# EasyEDA schematic 10MHz_reference_sch.json
TITLE: Sheet_1; REV: 1.0; Date: 2024-07-30; Sheet: 1/1; Drawn By: vinay.shanbhag; Company: Your Company
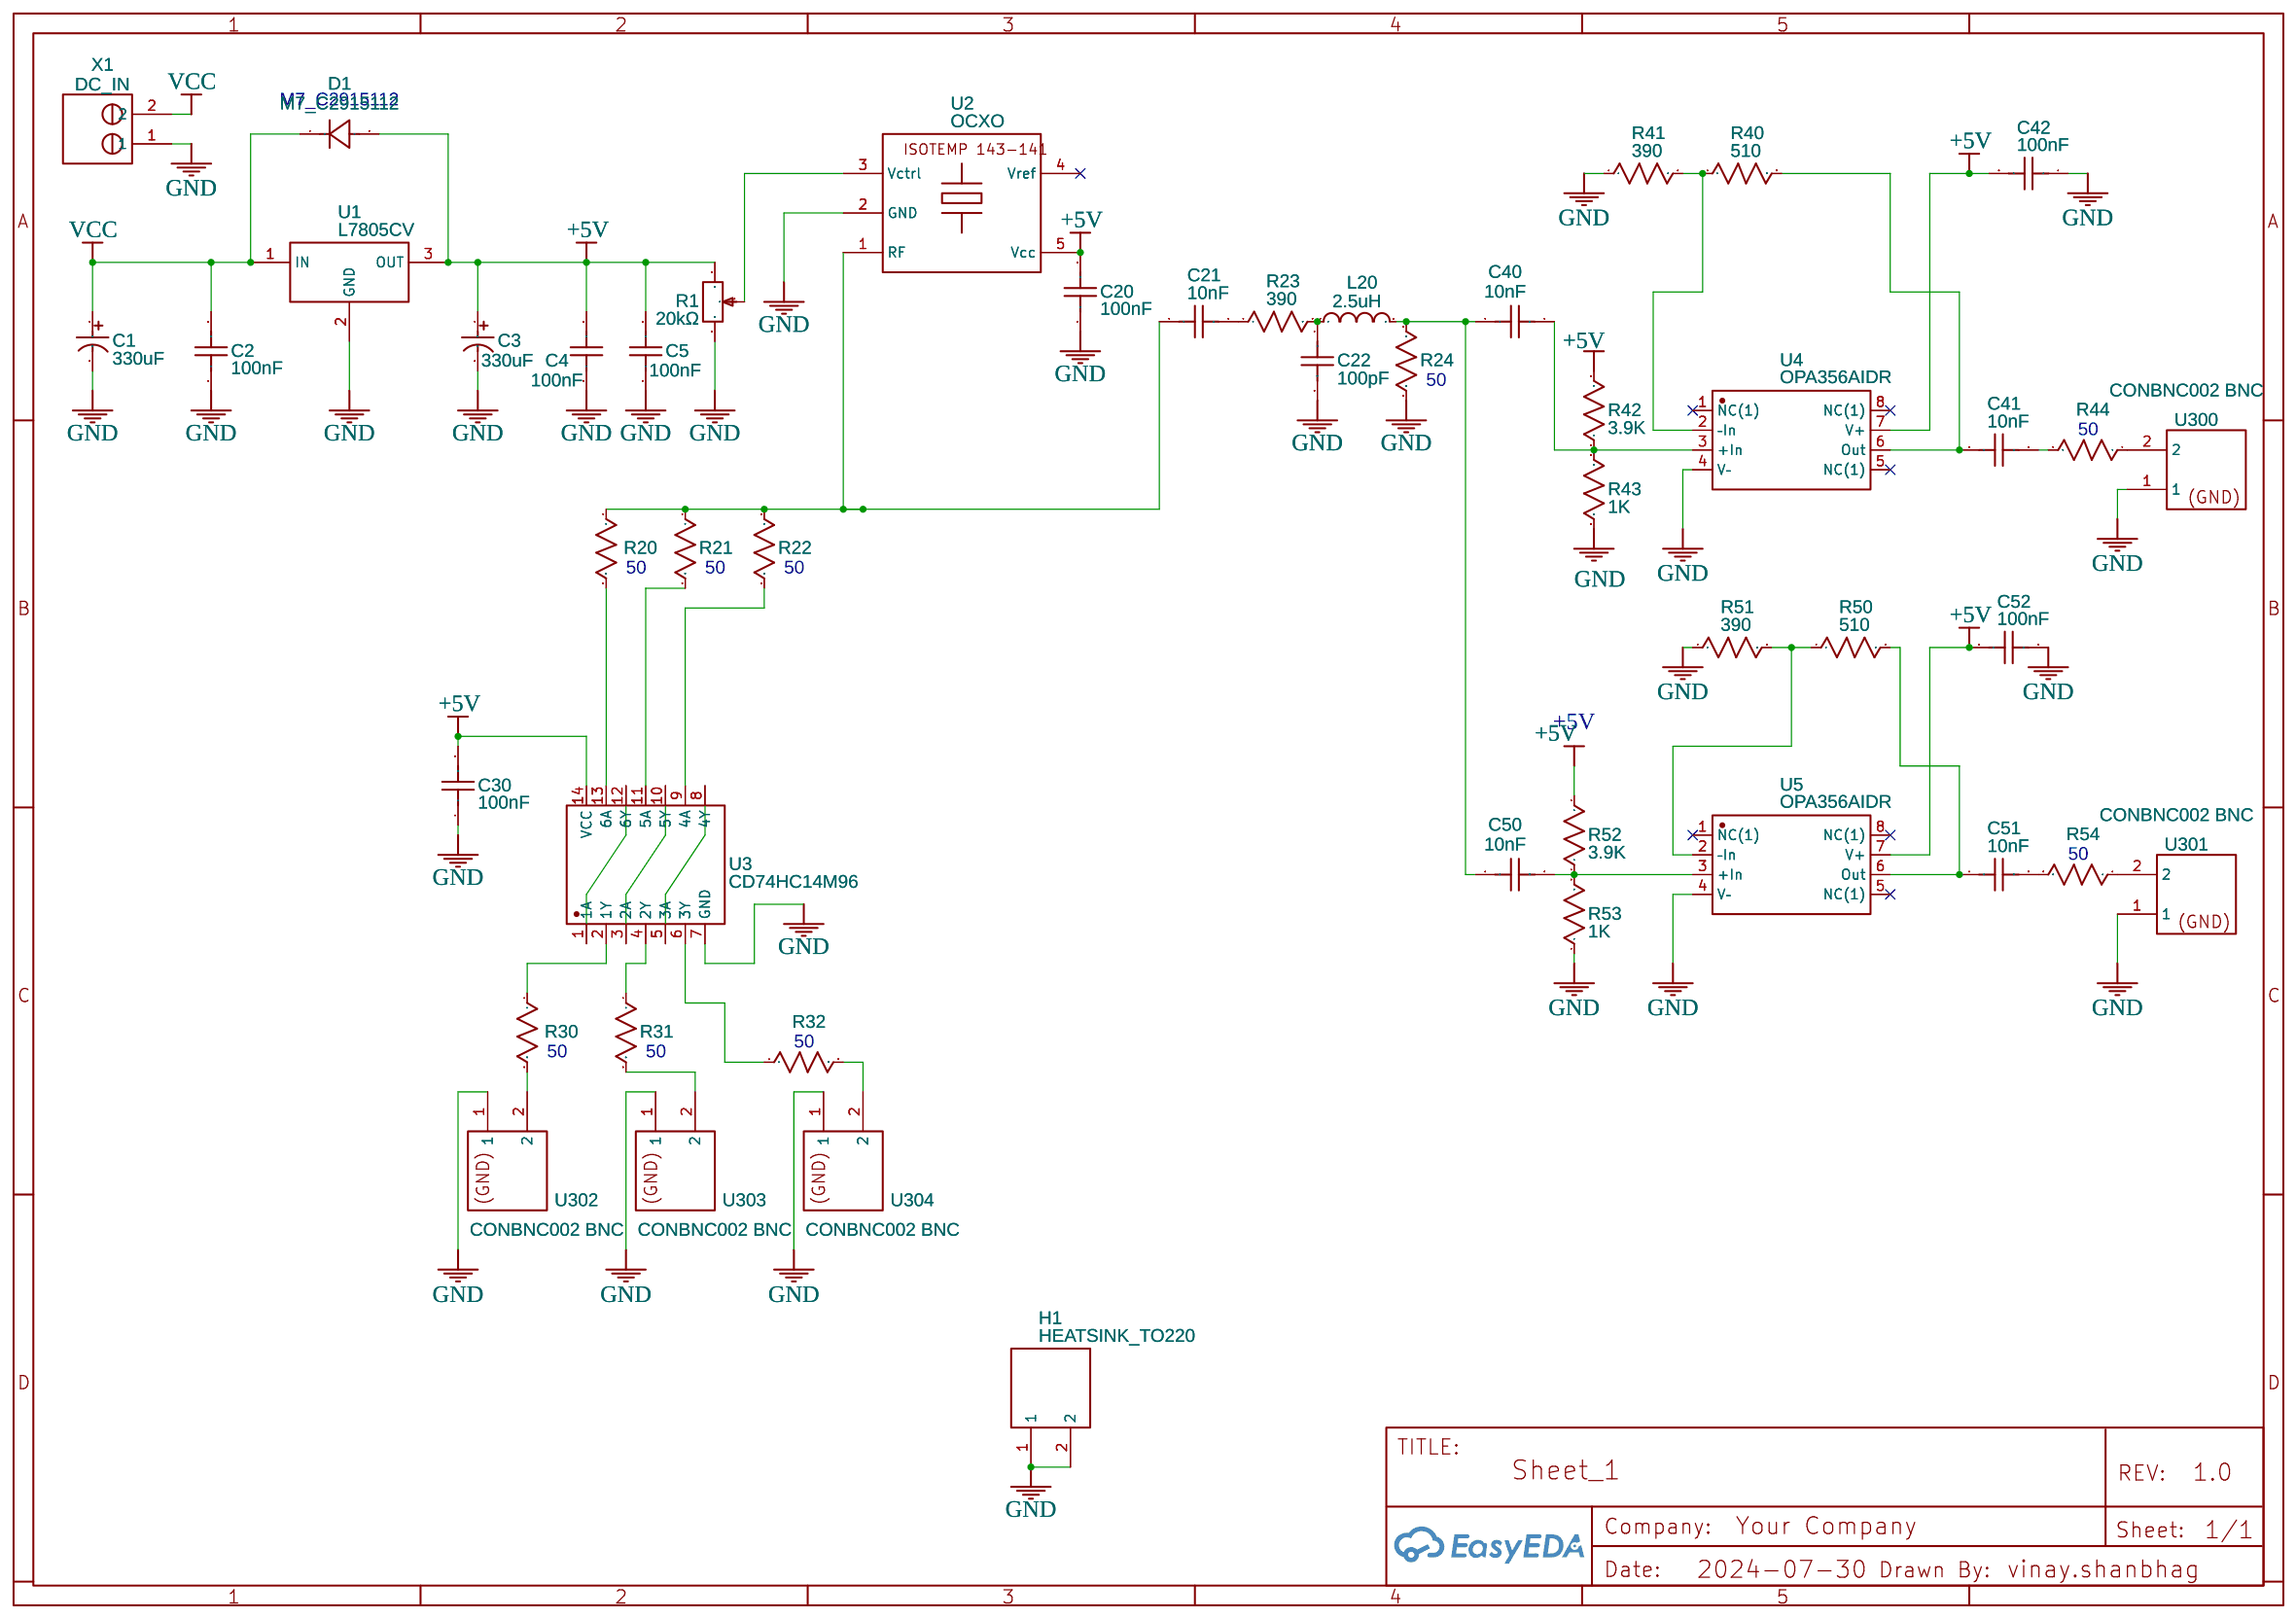
[diagram p0: schematic sheet]

## Parts
C1  330uF  [A750KS337M1EBAE018]
C2  100nF  [C1206]
C3  330uF  [A750KS337M1EBAE018]
C4  100nF  [C1206]
C5  100nF  [C1206]
C20  100nF  [C1206]
C21  10nF  [C1206]
C22  100pF  [C1206]
C30  100nF  [C1206]
C40  10nF  [C1206]
C41  10nF  [C1206]
C42  100nF  [C1206]
C50  10nF  [C1206]
C51  10nF  [C1206]
C52  100nF  [C1206]
D1  M7_C2915112  [SMA_L4.0-W2.5-LS5.4-RD]
H1  HEATSINK_TO220  [TO220_VERTICAL_HEATSINK_ONLY]
L20  2.5uH  [C1206]
R1  20kΩ  [POTENTIOMETER_TRIMMER_BOURNS_3296X]
R20  100  [C1206]
R21  100  [C1206]
R22  100  [C1206]
R23  390  [C1206]
R24  100  [C1206]
R30  100  [C1206]
R31  100  [C1206]
R32  100  [C1206]
R40  510  [C1206]
R41  390  [C1206]
R42  3.9K  [C1206]
R43  1K  [C1206]
R44  50  [C1206]
R50  510  [C1206]
R51  390  [C1206]
R52  3.9K  [C1206]
R53  1K  [C1206]
R54  50  [C1206]
U1  L7805CV  [L7805CV]
U2  OCXO  [ISOTEMP143-141_TYPE_A_OCXO]
U3  CD74HC14M96  [SOIC-14_L8.7-W3.9-P1.27-LS6.0-BL]
U4  OPA356AIDR  [SOIC-8_L4.9-W3.9-P1.27-LS6.0-BL]
U5  OPA356AIDR  [SOIC-8_L4.9-W3.9-P1.27-LS6.0-BL]
U300  CONBNC002 BNC  [CONBNC002  BNC]
U301  CONBNC002 BNC  [CONBNC002  BNC]
U302  CONBNC002 BNC  [CONBNC002  BNC]
U303  CONBNC002 BNC  [CONBNC002  BNC]
U304  CONBNC002 BNC  [CONBNC002  BNC]
X1  DC_IN  [TERMINAL_BLOCK_2P_5]

## Library data of the parts
C1 C3 = 330uF 35V 8*16Green high frequency: Supplier: LCSC; Manufacturer: CX(承兴); Manufacturer Part: GR337M035F16RR0VL4FP0; Supplier Part: C45079; JLCPCB Part Class: Extended Part
C2 C4 C5 C20 C30 C42 C52 = CC1206KRX7R9BB104: Supplier: LCSC; Manufacturer: YAGEO(国巨); Supplier Part: C82601; JLCPCB Part Class: Extended Part
C21 C22 C40 C41 C50 C51 = C_0603_US: Contributor: LCEDA_Lib
D1 = M7_C2915112: Contributor: lcsc; Convert to PCB: Yes; Add into BOM: Yes; Supplier: LCSC; Supplier Part: C2915112; Manufacturer: GOODWORK(固得沃克); Manufacturer Part: M7; JLCPCB Part Class: Extended Part
H1 = HEATSINK_TO220: Manufacturer Part: HEATSINK TO220; Contributor: ZaharSH
L20 = L0603_US: Contributor: LCEDA_Lib
R1 = 3296X-1-203LF: Resistance(Ohms): 20K; Supplier: LCSC; Manufacturer: BOURNS; Supplier Part: C111783; JLCPCB Part Class: Extended Part
R20-R24 R30-R32 R40-R44 R50-R54 = R_0603_US: Contributor: LCEDA_Lib
U1 = L7805CV: Supplier: LCSC; Manufacturer: ST(意法半导体); Supplier Part: C111887; JLCPCB Part Class: Extended Part
U2 = OCXO: Manufacturer: CTI; Manufacturer Part: OSC5A2B02 10Mhz; Supplier: CTI; Supplier Part: CTI OSC5A2B02 10Mhz OCXO; Contributor: tinhdhmo
U3 = CD74HC14M96: Contributor: LCSC; Supplier: LCSC; Supplier Part: C74640; Manufacturer: TI(德州仪器); JLCPCB Part Class: Extended Part
U4 U5 = OPA356AIDR: Contributor: LCSC; Supplier: LCSC; Supplier Part: C2059381; Manufacturer: TI(德州仪器); JLCPCB Part Class: Extended Part
U300-U304 = CONBNC002 BNC: Contributor: kyzuuh
X1 = 2PScrewTerminalBlock: catid: 20; Contributor: dbeaudry92; sim: true

## Nets
+5V: C3.1 C4.2 C5.2 C20.2 C30.2 C42.2 C52.2 D1.2(A) R1.1 R42.2 R52.2 U1.3(OUT) U2.5(Vcc) U3.14(VCC) U4.7(V+) U5.7(V+)
GND: C1.2 C2.1 C3.2 C4.1 C5.1 C20.1 C22.2 C30.1 C42.1 C52.1 H1.1 H1.2 R1.3 R24.2 R41.1 R43.1 R51.1 R53.1 U1.2(GND) U2.2(GND) U3.7(GND) U4.4(V–) U5.4(V–) U300.1 U301.1 U302.1 U303.1 U304.1 X1.1
VCC: C1.1 C2.2 D1.1(K) U1.1(IN) X1.2
Net-(C21-1): C21.1 R20.1 R21.1 R22.1 U2.1(RF)
Net-(C21-2): C21.2 R23.1
Net-(C22-1): C22.1 L20.1 R23.2
Net-(C40-1): C40.1 C50.1 L20.2 R24.1
Net-(C40-2): C40.2 R42.1 R43.2 U4.3(+In)
Net-(C41-1): C41.1 R40.2 U4.6(Out)
Net-(C41-2): C41.2 R44.2
Net-(C50-2): C50.2 R52.1 R53.2 U5.3(+In)
Net-(C51-1): C51.1 R50.2 U5.6(Out)
Net-(C51-2): C51.2 R54.2
Net-(R1-2): R1.2 U2.3(Vctrl)
Net-(R20-2): R20.2 U3.13(6A)
Net-(R21-2): R21.2 U3.11(5A)
Net-(R22-2): R22.2 U3.9(4A)
Net-(R30-1): R30.1 U3.2(1Y)
Net-(R30-2): R30.2 U302.2
Net-(R31-1): R31.1 U3.4(2Y)
Net-(R31-2): R31.2 U303.2
Net-(R32-1): R32.1 U3.6(3Y)
Net-(R32-2): R32.2 U304.2
Net-(R40-1): R40.1 R41.2 U4.2(–In)
Net-(R44-1): R44.1 U300.2
Net-(R50-1): R50.1 R51.2 U5.2(–In)
Net-(R54-1): R54.1 U301.2
Net-(U3-1): U3.1(1A) U3.12(6Y)
Net-(U3-3): U3.3(2A) U3.10(5Y)
Net-(U3-5): U3.5(3A) U3.8(4Y)

Not connected (* = marked no-connect by the designer): U2 4(Vref)*; U4 1(NC(1))* 5(NC(1))* 8(NC(1))*; U5 1(NC(1))* 5(NC(1))* 8(NC(1))*

## Notes on the sheet
- M7_C2915112
- 50
- 50
- 50
- 50
- 50
- +5V
- 50
- 50
- 50
- 50
